# Altium schematic sheet Sheet2.SchDoc
size A3
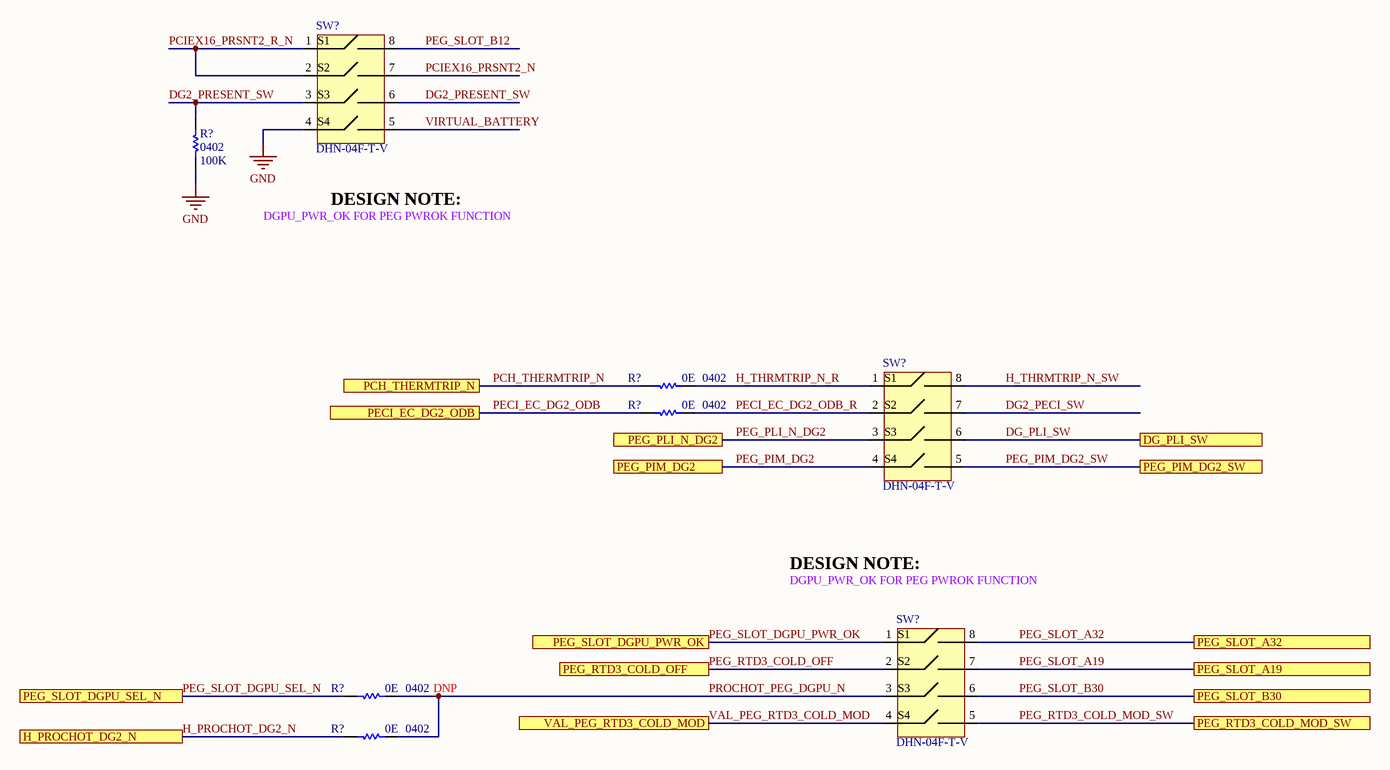
[diagram p0: Sheet2.SchDoc]

## Parts
(Parts that share a designator on the sheet are numbered #1, #2 ... from top to bottom, then left to right.)
R?#1  value 100K  Case/Package: 0402  [RESC0402]  (hidden comment: Res)
R?#2  value 0E  Case/Package: 0402  [RESC0402]  (hidden comment: Res)
R?#3  value 0E  Case/Package: 0402  [RESC0402]  (hidden comment: Res)
R?#4  value 0E  Case/Package: 0402  [RESC0402]  (hidden comment: Res)
R?#5  value 0E  Case/Package: 0402  [RESC0402]  (hidden comment: Res)
SW?#1  DHN-04F-T-V
SW?#2  DHN-04F-T-V
SW?#3  DHN-04F-T-V

## Ports
DG_PLI_SW, H_PROCHOT_DG2_N, PCH_THERMTRIP_N, PECI_EC_DG2_ODB, PEG_PIM_DG2, PEG_PIM_DG2_SW, PEG_PLI_N_DG2, PEG_RTD3_COLD_MOD_SW, PEG_RTD3_COLD_OFF, PEG_SLOT_A19, PEG_SLOT_A32, PEG_SLOT_B30, PEG_SLOT_DGPU_PWR_OK, PEG_SLOT_DGPU_SEL_N, VAL_PEG_RTD3_COLD_MOD

## Nets
GND: R?#1.1 SW?#1.4(S4)
DG2_PECI_SW: SW?#2.7
DG2_PRESENT_SW: R?#1.2 SW?#1.3(S3) SW?#1.6
DG_PLI_SW: SW?#2.6 ; port DG_PLI_SW
H_PROCHOT_DG2_N: R?#5.1 ; port H_PROCHOT_DG2_N
H_THRMTRIP_N_R: R?#2.2 SW?#2.1(S1)
H_THRMTRIP_N_SW: SW?#2.8
PCH_THERMTRIP_N: R?#2.1 ; port PCH_THERMTRIP_N
PCIEX16_PRSNT2_N: SW?#1.7
PCIEX16_PRSNT2_R_N: SW?#1.1(S1) SW?#1.2(S2)
PECI_EC_DG2_ODB: R?#3.1 ; port PECI_EC_DG2_ODB
PECI_EC_DG2_ODB_R: R?#3.2 SW?#2.2(S2)
PEG_PIM_DG2: SW?#2.4(S4) ; port PEG_PIM_DG2
PEG_PIM_DG2_SW: SW?#2.5 ; port PEG_PIM_DG2_SW
PEG_PLI_N_DG2: SW?#2.3(S3) ; port PEG_PLI_N_DG2
PEG_RTD3_COLD_MOD_SW: SW?#3.5 ; port PEG_RTD3_COLD_MOD_SW
PEG_RTD3_COLD_OFF: SW?#3.2(S2) ; port PEG_RTD3_COLD_OFF
PEG_SLOT_A19: SW?#3.7 ; port PEG_SLOT_A19
PEG_SLOT_A32: SW?#3.8 ; port PEG_SLOT_A32
PEG_SLOT_B12: SW?#1.8
PEG_SLOT_B30: SW?#3.6 ; port PEG_SLOT_B30
PEG_SLOT_DGPU_PWR_OK: SW?#3.1(S1) ; port PEG_SLOT_DGPU_PWR_OK
PEG_SLOT_DGPU_SEL_N: R?#4.1 ; port PEG_SLOT_DGPU_SEL_N
PROCHOT_PEG_DGPU_N: R?#4.2 R?#5.2 SW?#3.3(S3)
VAL_PEG_RTD3_COLD_MOD: SW?#3.4(S4) ; port VAL_PEG_RTD3_COLD_MOD
VIRTUAL_BATTERY: SW?#1.5

## Notes on the sheet
- DGPU_PWR_OK FOR PEG PWROK FUNCTION
- DESIGN NOTE:

## Library data of the parts
R?#1 = Res: Thick Film Resistor - 100Kohm, 1%, 0402
R?#2-R?#5 = Res: Thick Film Resistor -  0ohm, 1%, 0402
  R?#4: DNP: DNP